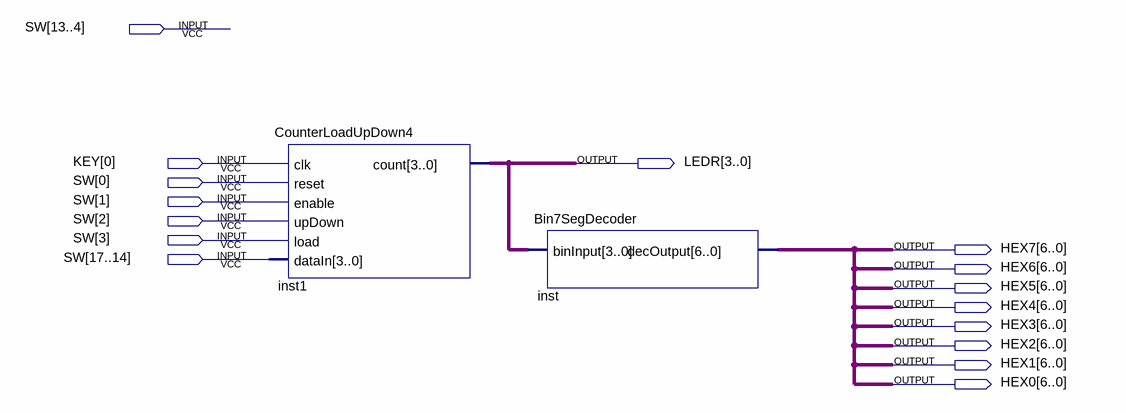
[diagram p0: schematic sheet]
// Quartus schematic Counter_Demo.bdf as structural Verilog: 2 symbols, 16 pins
module Counter_Demo (
  input  [17:0] SW,
  input  [0:0] KEY,
  output [3:0] LEDR,
  output [6:0] HEX7,
  output [6:0] HEX6,
  output [6:0] HEX5,
  output [6:0] HEX4,
  output [6:0] HEX3,
  output [6:0] HEX2,
  output [6:0] HEX1,
  output [6:0] HEX0
);

  CounterLoadUpDown4 inst1 (
    .clk(KEY[0]), .reset(SW[0]), .enable(SW[1]), .upDown(SW[2]), .load(SW[3]), .dataIn(SW[17:14]),
    .count(LEDR));
  Bin7SegDecoder inst (.binInput(LEDR), .decOutput(HEX0));

  assign HEX1 = HEX0;
  assign HEX2 = HEX0;
  assign HEX3 = HEX0;
  assign HEX4 = HEX0;
  assign HEX5 = HEX0;
  assign HEX6 = HEX0;
  assign HEX7 = HEX0;
endmodule
